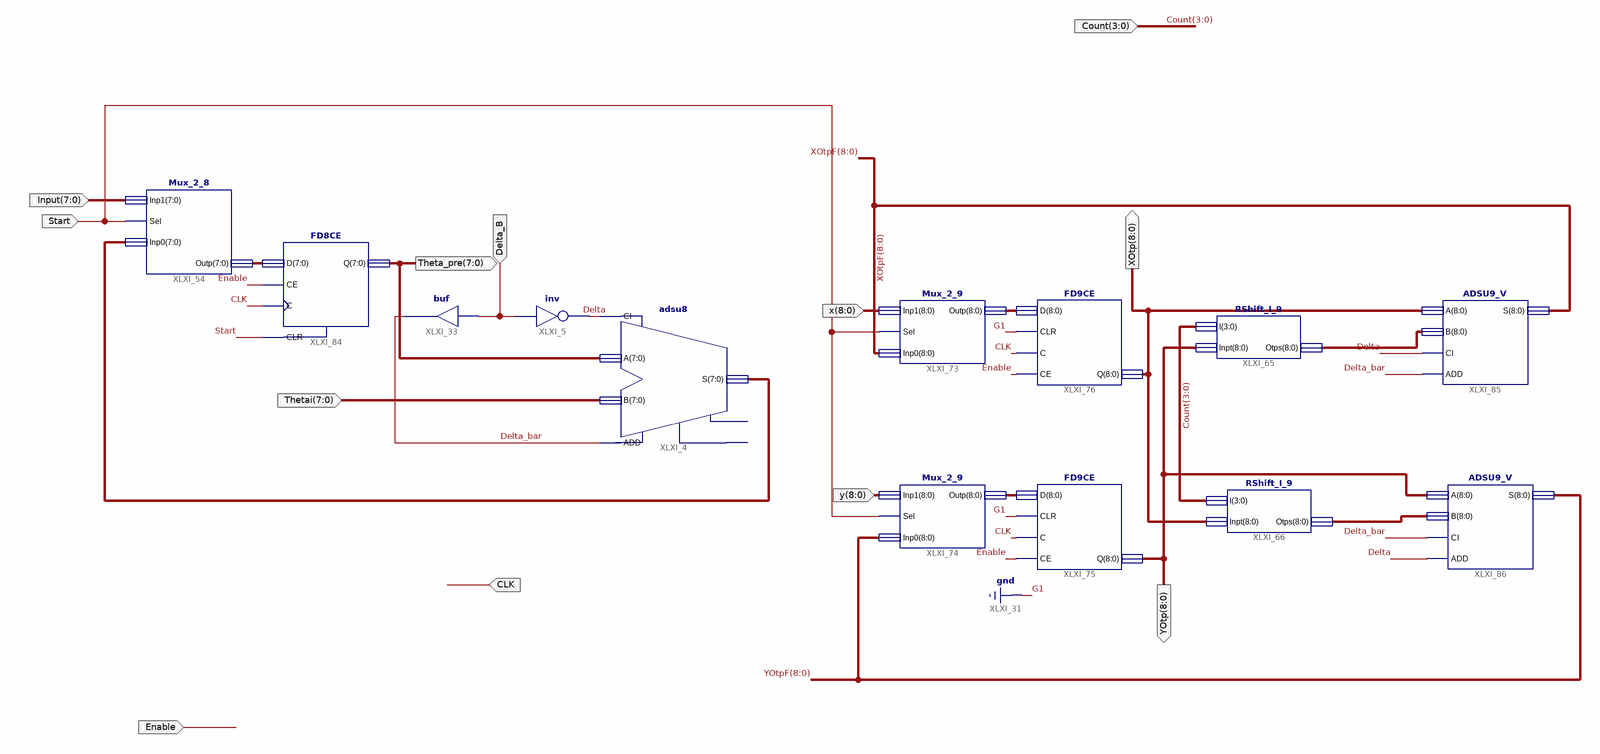
[diagram p0: schematic sheet 1]
// Xilinx ISE schematic Cordic.sch (spartan3e) as structural Verilog: 13 symbols, 12 ports
module Cordic (
  input  [7:0] Thetai,
  input  [7:0] Input,
  input  CLK,
  input  [3:0] Count,
  input  Enable,
  input  [8:0] y,
  input  [8:0] x,
  input  Delta_B,
  input  Start,
  output [8:0] XOtp,
  output [8:0] YOtp,
  output [7:0] Theta_pre
);

  wire Delta, Delta_bar;
  wire [7:0] XLXN_176, XLXN_180;
  wire [8:0] XLXN_79, XLXN_106, XLXN_191, XLXN_197, XOtpF, YOtpF;

  adsu8 XLXI_4 (.A(Theta_pre), .ADD(Delta_bar), .B(Thetai), .CI(Delta), .S(XLXN_176));  // open: CO, OFL
  not XLXI_5 (Delta, Delta_B);
  buf XLXI_33 (Delta_bar, Delta_B);
  Mux_2_8 XLXI_54 (.Inp1(Input), .Sel(Start), .Inp0(XLXN_176), .Outp(XLXN_180));
  RShift_I_9 XLXI_65 (.Inpt(YOtp), .I(Count), .Otps(XLXN_106));
  RShift_I_9 XLXI_66 (.Inpt(XOtp), .I(Count), .Otps(XLXN_79));
  Mux_2_9 XLXI_73 (.Inp1(x), .Inp0(XOtpF), .Sel(Start), .Outp(XLXN_197));
  Mux_2_9 XLXI_74 (.Inp1(y), .Inp0(YOtpF), .Sel(Start), .Outp(XLXN_191));
  FD9CE XLXI_75 (.CE(Enable), .C(CLK), .CLR(1'b0), .D(XLXN_191), .Q(YOtp));
  FD9CE XLXI_76 (.CE(Enable), .C(CLK), .CLR(1'b0), .D(XLXN_197), .Q(XOtp));
  FD8CE XLXI_84 (.D(XLXN_180), .CE(Enable), .C(CLK), .CLR(Start), .Q(Theta_pre));
  ADSU9_V XLXI_85 (.S(XOtpF), .CI(Delta), .ADD(Delta_bar), .A(XOtp), .B(XLXN_106));
  ADSU9_V XLXI_86 (.S(YOtpF), .CI(Delta_bar), .ADD(Delta), .A(YOtp), .B(XLXN_79));
endmodule
